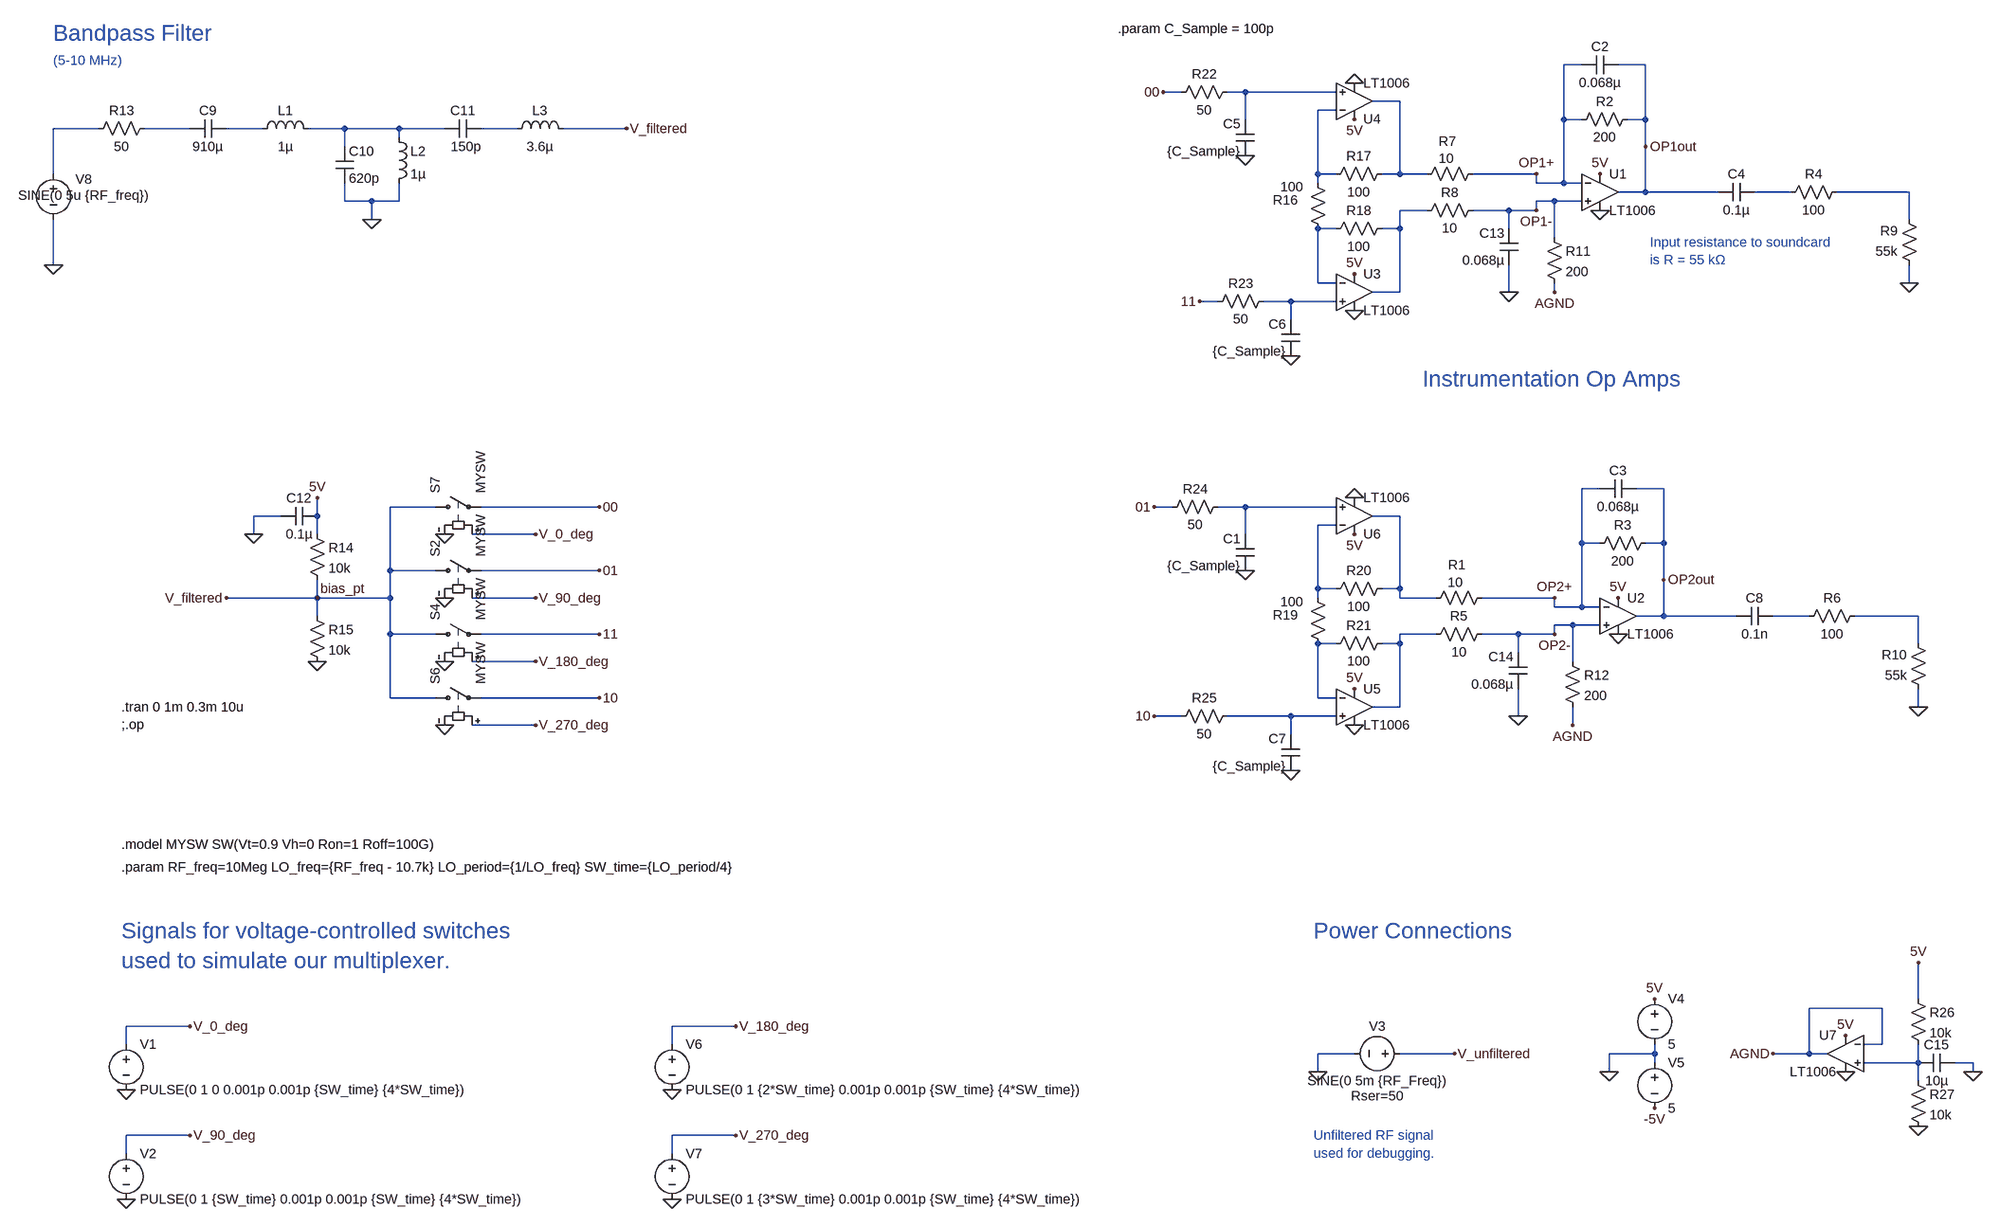
[diagram p0: schematic RecieverSimulation_1c.asc]
RecieverSimulation_1c.asc, the LTspice schematic file:
Version 4
SHEET 1 2720 1748
WIRE 1824 -1088 1792 -1088
WIRE 1936 -1088 1888 -1088
WIRE 1120 -1040 1088 -1040
WIRE 1232 -1040 1200 -1040
WIRE 1392 -1040 1232 -1040
WIRE 1504 -1024 1456 -1024
WIRE 1392 -1008 1360 -1008
WIRE 1232 -992 1232 -1040
WIRE 1792 -992 1792 -1088
WIRE 1824 -992 1792 -992
WIRE 1936 -992 1936 -1088
WIRE 1936 -992 1904 -992
WIRE -784 -976 -864 -976
WIRE -624 -976 -704 -976
WIRE -496 -976 -560 -976
WIRE -352 -976 -416 -976
WIRE -256 -976 -352 -976
WIRE -176 -976 -256 -976
WIRE -48 -976 -112 -976
WIRE 144 -976 32 -976
WIRE -256 -960 -256 -976
WIRE -352 -944 -352 -976
WIRE 1936 -944 1936 -992
WIRE -864 -896 -864 -976
WIRE 1360 -896 1360 -1008
WIRE 1392 -896 1360 -896
WIRE 1504 -896 1504 -1024
WIRE 1504 -896 1472 -896
WIRE 1552 -896 1504 -896
WIRE 1744 -896 1632 -896
WIRE 1360 -880 1360 -896
WIRE 1744 -880 1744 -896
WIRE 1792 -880 1792 -992
WIRE 1792 -880 1744 -880
WIRE 1824 -880 1792 -880
WIRE 1936 -864 1936 -944
WIRE 1936 -864 1888 -864
WIRE 2064 -864 1936 -864
WIRE 2192 -864 2128 -864
WIRE 2400 -864 2272 -864
WIRE -352 -848 -352 -880
WIRE -304 -848 -352 -848
WIRE -256 -848 -256 -880
WIRE -256 -848 -304 -848
WIRE 1776 -848 1744 -848
WIRE 1824 -848 1776 -848
WIRE 1552 -832 1504 -832
WIRE 1696 -832 1632 -832
WIRE 1744 -832 1744 -848
WIRE 1744 -832 1696 -832
WIRE -304 -816 -304 -848
WIRE 2400 -816 2400 -864
WIRE 1392 -800 1360 -800
WIRE 1504 -800 1504 -832
WIRE 1504 -800 1472 -800
WIRE 1696 -800 1696 -832
WIRE 1776 -784 1776 -848
WIRE -864 -736 -864 -816
WIRE 1360 -704 1360 -800
WIRE 1392 -704 1360 -704
WIRE 2400 -704 2400 -736
WIRE 1504 -688 1504 -800
WIRE 1504 -688 1456 -688
WIRE 1696 -688 1696 -736
WIRE 1776 -688 1776 -704
WIRE 1184 -672 1152 -672
WIRE 1312 -672 1264 -672
WIRE 1392 -672 1312 -672
WIRE 1312 -640 1312 -672
WIRE 1856 -224 1824 -224
WIRE 1968 -224 1920 -224
WIRE -192 -192 -272 -192
WIRE 96 -192 -112 -192
WIRE 1104 -192 1072 -192
WIRE 1232 -192 1184 -192
WIRE 1392 -192 1232 -192
WIRE -464 -176 -512 -176
WIRE -400 -176 -400 -208
WIRE 1504 -176 1456 -176
WIRE 1392 -160 1360 -160
WIRE -512 -144 -512 -176
WIRE -400 -144 -400 -176
WIRE -16 -144 -128 -144
WIRE 1232 -144 1232 -192
WIRE 1824 -128 1824 -224
WIRE 1856 -128 1824 -128
WIRE 1968 -128 1968 -224
WIRE 1968 -128 1936 -128
WIRE -272 -80 -272 -192
WIRE -192 -80 -272 -80
WIRE 96 -80 -112 -80
WIRE 1968 -64 1968 -128
WIRE 1360 -48 1360 -160
WIRE 1392 -48 1360 -48
WIRE 1504 -48 1504 -176
WIRE 1504 -48 1472 -48
WIRE -400 -32 -400 -64
WIRE -400 -32 -560 -32
WIRE -272 -32 -272 -80
WIRE -272 -32 -400 -32
WIRE -16 -32 -128 -32
WIRE 1360 -32 1360 -48
WIRE 1504 -32 1504 -48
WIRE 1568 -32 1504 -32
WIRE 1776 -32 1648 -32
WIRE 1776 -16 1776 -32
WIRE 1824 -16 1824 -128
WIRE 1824 -16 1776 -16
WIRE 1856 -16 1824 -16
WIRE -400 0 -400 -32
WIRE 1968 0 1968 -64
WIRE 1968 0 1920 0
WIRE 2096 0 1968 0
WIRE 2224 0 2160 0
WIRE 2416 0 2304 0
WIRE 1808 16 1776 16
WIRE 1856 16 1808 16
WIRE -272 32 -272 -32
WIRE -192 32 -272 32
WIRE 96 32 -112 32
WIRE 1568 32 1504 32
WIRE 1712 32 1648 32
WIRE 1776 32 1776 16
WIRE 1776 32 1712 32
WIRE 1392 48 1360 48
WIRE 1504 48 1504 32
WIRE 1504 48 1472 48
WIRE 2416 48 2416 0
WIRE 1712 64 1712 32
WIRE -16 80 -128 80
WIRE 1808 80 1808 16
WIRE -272 144 -272 32
WIRE -192 144 -272 144
WIRE 96 144 -112 144
WIRE 1360 144 1360 48
WIRE 1392 144 1360 144
WIRE 1504 160 1504 48
WIRE 1504 160 1456 160
WIRE 2416 160 2416 128
WIRE 1120 176 1072 176
WIRE 1312 176 1200 176
WIRE 1392 176 1312 176
WIRE 1712 176 1712 128
WIRE -16 192 -128 192
WIRE 1808 192 1808 160
WIRE 1312 208 1312 176
WIRE 2416 752 2416 688
WIRE 2352 768 2224 768
WIRE -624 800 -736 800
WIRE 336 800 224 800
WIRE -736 832 -736 800
WIRE 224 832 224 800
WIRE 2352 832 2352 768
WIRE 2352 832 2320 832
WIRE 1424 848 1360 848
WIRE 1600 848 1504 848
WIRE 1952 848 1952 832
WIRE 1952 848 1872 848
WIRE 2224 848 2224 768
WIRE 2224 848 2160 848
WIRE 2256 848 2224 848
WIRE 1952 864 1952 848
WIRE 2416 864 2416 832
WIRE 2416 864 2320 864
WIRE 2512 864 2480 864
WIRE 1360 880 1360 848
WIRE 1872 880 1872 848
WIRE 2512 880 2512 864
WIRE 2416 896 2416 864
WIRE -624 992 -736 992
WIRE 336 992 224 992
WIRE -736 1024 -736 992
WIRE 224 1024 224 992
FLAG -176 -144 0
FLAG -176 -32 0
FLAG -176 80 0
FLAG -176 192 0
FLAG 1360 880 0
FLAG 1952 752 5V
FLAG 1312 -576 0
FLAG 1232 -928 0
FLAG 1744 -896 OP1+
FLAG 1776 32 OP2-
FLAG 1744 -832 OP1-
FLAG 1936 -944 OP1out
FLAG 1968 -64 OP2out
FLAG 1776 -32 OP2+
FLAG 2400 -704 0
FLAG 2416 160 0
FLAG 1872 880 0
FLAG 1952 944 -5V
FLAG -16 -144 V_0_deg
FLAG -16 -32 V_90_deg
FLAG -16 80 V_180_deg
FLAG -16 192 V_270_deg
FLAG -736 912 0
FLAG -624 800 V_0_deg
FLAG -736 1104 0
FLAG -624 992 V_90_deg
FLAG 224 912 0
FLAG 336 800 V_180_deg
FLAG 224 1104 0
FLAG 336 992 V_270_deg
FLAG 96 -192 00
FLAG 96 32 11
FLAG 1088 -1040 00
FLAG 1152 -672 11
FLAG -864 -736 0
FLAG -304 -816 0
FLAG 144 -976 V_filtered
FLAG 1600 848 V_unfiltered
FLAG -560 -32 V_filtered
FLAG -400 -208 5V
FLAG -400 80 0
FLAG -400 -32 bias_pt
FLAG -512 -144 0
FLAG 1856 -832 0
FLAG 1856 -896 5V
FLAG 1424 -992 5V
FLAG 1424 -1056 0
FLAG 1424 -656 0
FLAG 1424 -720 5V
FLAG 1312 272 0
FLAG 1232 -80 0
FLAG 1072 -192 01
FLAG 1072 176 10
FLAG 1424 -144 5V
FLAG 1424 -208 0
FLAG 1424 192 0
FLAG 1424 128 5V
FLAG 96 -80 01
FLAG 96 144 10
FLAG 1696 -688 0
FLAG 1712 176 0
FLAG 1888 32 0
FLAG 1888 -32 5V
FLAG 2416 688 5V
FLAG 2416 976 0
FLAG 2512 880 0
FLAG 2160 848 AGND
FLAG 1776 -688 AGND
FLAG 1808 192 AGND
FLAG 2288 880 0
FLAG 2288 816 5V
SYMBOL sw -208 -192 R270
SYMATTR InstName S7
SYMATTR Value MYSW
SYMBOL sw -208 -80 R270
SYMATTR InstName S2
SYMATTR Value MYSW
SYMBOL sw -208 32 R270
SYMATTR InstName S4
SYMATTR Value MYSW
SYMBOL sw -208 144 R270
SYMATTR InstName S6
SYMATTR Value MYSW
SYMBOL voltage 1520 848 R90
WINDOW 0 -32 56 VBottom 2
WINDOW 3 32 56 VTop 2
WINDOW 123 0 0 Left 0
WINDOW 39 90 56 VBottom 2
SYMATTR InstName V3
SYMATTR Value SINE(0 5m {RF_Freq})
SYMATTR SpiceLine Rser=50
SYMBOL voltage 1952 736 R0
WINDOW 123 0 0 Left 0
WINDOW 39 0 0 Left 0
SYMATTR InstName V4
SYMATTR Value 5
SYMBOL cap 1248 -928 R180
WINDOW 0 24 56 Left 2
WINDOW 3 24 8 Left 2
SYMATTR InstName C5
SYMATTR Value {C_Sample}
SYMBOL cap 1328 -576 R180
WINDOW 0 24 56 Left 2
WINDOW 3 24 8 Left 2
SYMATTR InstName C6
SYMATTR Value {C_Sample}
SYMBOL res 1536 -880 R270
WINDOW 0 58 52 VTop 2
WINDOW 3 59 50 VBottom 2
SYMATTR InstName R7
SYMATTR Value 10
SYMBOL res 1648 -848 R90
WINDOW 0 0 56 VBottom 2
WINDOW 3 32 56 VTop 2
SYMATTR InstName R8
SYMATTR Value 10
SYMBOL res 1920 -1008 R90
WINDOW 0 0 56 VBottom 2
WINDOW 3 32 56 VTop 2
SYMATTR InstName R2
SYMATTR Value 200
SYMBOL cap 1888 -1104 R90
WINDOW 0 0 32 VBottom 2
WINDOW 3 32 32 VTop 2
SYMATTR InstName C2
SYMATTR Value 0.068µ
SYMBOL res 1952 -144 R90
WINDOW 0 0 56 VBottom 2
WINDOW 3 32 56 VTop 2
SYMATTR InstName R3
SYMATTR Value 200
SYMBOL cap 1920 -240 R90
WINDOW 0 0 32 VBottom 2
WINDOW 3 32 32 VTop 2
SYMATTR InstName C3
SYMATTR Value 0.068µ
SYMBOL cap 2128 -880 R90
WINDOW 0 0 32 VBottom 2
WINDOW 3 32 32 VTop 2
SYMATTR InstName C4
SYMATTR Value 0.1µ
SYMBOL cap 2160 -16 R90
WINDOW 0 0 32 VBottom 2
WINDOW 3 32 32 VTop 2
SYMATTR InstName C8
SYMATTR Value 0.1n
SYMBOL res 2288 -880 R90
WINDOW 0 0 56 VBottom 2
WINDOW 3 32 56 VTop 2
SYMATTR InstName R4
SYMATTR Value 100
SYMBOL res 2320 -16 R90
WINDOW 0 0 56 VBottom 2
WINDOW 3 32 56 VTop 2
SYMATTR InstName R6
SYMATTR Value 100
SYMBOL res 2416 -720 R180
WINDOW 0 36 76 Left 2
WINDOW 3 36 40 Left 2
SYMATTR InstName R9
SYMATTR Value 55k
SYMBOL res 2432 144 R180
WINDOW 0 36 76 Left 2
WINDOW 3 36 40 Left 2
SYMATTR InstName R10
SYMATTR Value 55k
SYMBOL voltage 1952 848 R0
WINDOW 123 0 0 Left 0
WINDOW 39 0 0 Left 0
SYMATTR InstName V5
SYMATTR Value 5
SYMBOL res 1760 -800 R0
SYMATTR InstName R11
SYMATTR Value 200
SYMBOL res 1792 64 R0
SYMATTR InstName R12
SYMATTR Value 200
SYMBOL voltage -736 816 R0
WINDOW 123 0 0 Left 0
WINDOW 39 0 0 Left 0
SYMATTR InstName V1
SYMATTR Value PULSE(0 1 0 0.001p 0.001p {SW_time} {4*SW_time})
SYMBOL voltage -736 1008 R0
WINDOW 123 0 0 Left 0
WINDOW 39 0 0 Left 0
SYMATTR InstName V2
SYMATTR Value PULSE(0 1 {SW_time} 0.001p 0.001p {SW_time} {4*SW_time})
SYMBOL voltage 224 816 R0
WINDOW 123 0 0 Left 0
WINDOW 39 0 0 Left 0
SYMATTR InstName V6
SYMATTR Value PULSE(0 1 {2*SW_time} 0.001p 0.001p {SW_time} {4*SW_time})
SYMBOL voltage 224 1008 R0
WINDOW 123 0 0 Left 0
WINDOW 39 0 0 Left 0
SYMATTR InstName V7
SYMATTR Value PULSE(0 1 {3*SW_time} 0.001p 0.001p {SW_time} {4*SW_time})
SYMBOL voltage -864 -912 R0
WINDOW 0 53 41 Bottom 2
WINDOW 3 53 69 Bottom 2
WINDOW 123 0 0 Left 0
WINDOW 39 60 56 VTop 2
SYMATTR InstName V8
SYMATTR Value SINE(0 5u {RF_freq})
SYMBOL cap -560 -992 R90
WINDOW 0 0 32 VBottom 2
WINDOW 3 32 32 VTop 2
SYMATTR InstName C9
SYMATTR Value 910µ
SYMBOL ind -512 -960 R270
WINDOW 0 32 56 VTop 2
WINDOW 3 0 56 VBottom 2
SYMATTR InstName L1
SYMATTR Value 1µ
SYMBOL cap -368 -944 R0
SYMATTR InstName C10
SYMATTR Value 620p
SYMBOL ind -272 -976 R0
SYMATTR InstName L2
SYMATTR Value 1µ
SYMBOL cap -112 -992 R90
WINDOW 0 0 32 VBottom 2
WINDOW 3 32 26 VTop 2
SYMATTR InstName C11
SYMATTR Value 150p
SYMBOL ind -64 -960 R270
WINDOW 0 32 56 VTop 2
WINDOW 3 0 56 VBottom 2
SYMATTR InstName L3
SYMATTR Value 3.6µ
SYMBOL res -688 -992 R90
WINDOW 0 0 56 VBottom 2
WINDOW 3 32 56 VTop 2
SYMATTR InstName R13
SYMATTR Value 50
SYMBOL res -416 -160 R0
SYMATTR InstName R14
SYMATTR Value 10k
SYMBOL res -416 -16 R0
SYMATTR InstName R15
SYMATTR Value 10k
SYMBOL cap -400 -192 R90
WINDOW 0 0 32 VBottom 2
WINDOW 3 32 32 VTop 2
SYMATTR InstName C12
SYMATTR Value 0.1µ
SYMBOL Opamps\\LT1006 1856 -928 R0
SYMATTR InstName U1
SYMBOL Opamps\\LT1006 1424 -752 R0
SYMATTR InstName U3
SYMBOL Opamps\\LT1006 1424 -960 M180
SYMATTR InstName U4
SYMBOL res 1344 -896 R0
WINDOW 0 -63 46 Left 2
WINDOW 3 -50 23 Left 2
SYMATTR InstName R16
SYMATTR Value 100
SYMBOL res 1488 -912 R90
WINDOW 0 0 56 VBottom 2
WINDOW 3 32 56 VTop 2
SYMATTR InstName R17
SYMATTR Value 100
SYMBOL res 1488 -816 R90
WINDOW 0 0 56 VBottom 2
WINDOW 3 32 56 VTop 2
SYMATTR InstName R18
SYMATTR Value 100
SYMBOL cap 1248 -80 R180
WINDOW 0 24 56 Left 2
WINDOW 3 24 8 Left 2
SYMATTR InstName C1
SYMATTR Value {C_Sample}
SYMBOL cap 1328 272 R180
WINDOW 0 24 56 Left 2
WINDOW 3 24 8 Left 2
SYMATTR InstName C7
SYMATTR Value {C_Sample}
SYMBOL Opamps\\LT1006 1424 96 R0
SYMATTR InstName U5
SYMBOL Opamps\\LT1006 1424 -112 M180
SYMATTR InstName U6
SYMBOL res 1344 -48 R0
WINDOW 0 -63 46 Left 2
WINDOW 3 -50 23 Left 2
SYMATTR InstName R19
SYMATTR Value 100
SYMBOL res 1488 -64 R90
WINDOW 0 0 56 VBottom 2
WINDOW 3 32 56 VTop 2
SYMATTR InstName R20
SYMATTR Value 100
SYMBOL res 1488 32 R90
WINDOW 0 0 56 VBottom 2
WINDOW 3 32 56 VTop 2
SYMATTR InstName R21
SYMATTR Value 100
SYMBOL cap 1712 -736 R180
WINDOW 0 24 56 Left 2
WINDOW 3 24 8 Left 2
SYMATTR InstName C13
SYMATTR Value 0.068µ
SYMBOL res 1552 -16 R270
WINDOW 0 58 52 VTop 2
WINDOW 3 59 50 VBottom 2
SYMATTR InstName R1
SYMATTR Value 10
SYMBOL res 1664 16 R90
WINDOW 0 0 56 VBottom 2
WINDOW 3 32 56 VTop 2
SYMATTR InstName R5
SYMATTR Value 10
SYMBOL cap 1728 128 R180
WINDOW 0 24 56 Left 2
WINDOW 3 24 8 Left 2
SYMATTR InstName C14
SYMATTR Value 0.068µ
SYMBOL res 1216 -1056 R90
WINDOW 0 0 56 VBottom 2
WINDOW 3 32 56 VTop 2
SYMATTR InstName R22
SYMATTR Value 50
SYMBOL res 1280 -688 R90
WINDOW 0 0 56 VBottom 2
WINDOW 3 32 56 VTop 2
SYMATTR InstName R23
SYMATTR Value 50
SYMBOL res 1200 -208 R90
WINDOW 0 0 56 VBottom 2
WINDOW 3 32 56 VTop 2
SYMATTR InstName R24
SYMATTR Value 50
SYMBOL res 1216 160 R90
WINDOW 0 0 56 VBottom 2
WINDOW 3 32 56 VTop 2
SYMATTR InstName R25
SYMATTR Value 50
SYMBOL Opamps\\LT1006 1888 -64 R0
SYMATTR InstName U2
SYMBOL res 2400 736 R0
SYMATTR InstName R26
SYMATTR Value 10k
SYMBOL res 2400 880 R0
SYMATTR InstName R27
SYMATTR Value 10k
SYMBOL cap 2416 880 R270
WINDOW 0 32 32 VTop 2
WINDOW 3 0 32 VBottom 2
SYMATTR InstName C15
SYMATTR Value 10µ
SYMBOL Opamps\\LT1006 2288 784 M0
SYMATTR InstName U7
TEXT -744 480 Left 2 !.model MYSW SW(Vt=0.9 Vh=0 Ron=1 Roff=100G)
TEXT -744 160 Left 2 !.tran 0 1m 0.3m 10u\n;.op
TEXT -744 520 Left 2 !.param RF_freq=10Meg LO_freq={RF_freq - 10.7k} LO_period={1/LO_freq} SW_time={LO_period/4}
TEXT 1008 -1152 Left 2 !.param C_Sample = 100p
TEXT -744 632 Left 4 ;Signals for voltage-controlled switches \nused to simulate our multiplexer.
TEXT 1944 -776 Left 2 ;Input resistance to soundcard\nis R = 55 kΩ
TEXT 1544 -536 Left 4 ;Instrumentation Op Amps
TEXT -864 -1144 Left 4 ;Bandpass Filter
TEXT -864 -1096 Left 2 ;(5-10 MHz)
TEXT 1352 632 Left 4 ;Power Connections
TEXT 1352 992 Left 2 ;Unfiltered RF signal\nused for debugging.

The netlist it stands for:
* RecieverSimulation_1c.asc
S7 bias_pt 00 V_0_deg 0 MYSW
S2 bias_pt 01 V_90_deg 0 MYSW
S4 bias_pt 11 V_180_deg 0 MYSW
S6 bias_pt 10 V_270_deg 0 MYSW
V3 V_unfiltered 0 SINE(0 5m {RF_Freq}) Rser=50
V4 5V 0 5
C5 0 N001 {C_Sample}
C6 0 N013 {C_Sample}
R7 N002 OP1+ 10
R8 OP1- N011 10
R2 OP1out OP1+ 200
C2 OP1out OP1+ 0.068µ
R3 OP2out OP2+ 200
C3 OP2out OP2+ 0.068µ
C4 N009 OP1out 0.1µ
C8 N017 OP2out 0.1n
R4 N010 N009 100
R6 N018 N017 100
R9 0 N010 55k
R10 0 N018 55k
V5 0 -5V 5
R11 OP1- AGND 200
R12 OP2- AGND 200
V1 V_0_deg 0 PULSE(0 1 0 0.001p 0.001p {SW_time} {4*SW_time})
V2 V_90_deg 0 PULSE(0 1 {SW_time} 0.001p 0.001p {SW_time} {4*SW_time})
V6 V_180_deg 0 PULSE(0 1 {2*SW_time} 0.001p 0.001p {SW_time} {4*SW_time})
V7 V_270_deg 0 PULSE(0 1 {3*SW_time} 0.001p 0.001p {SW_time} {4*SW_time})
V8 N004 0 SINE(0 5u {RF_freq})
C9 N006 N005 910µ
L1 N006 N007 1µ
C10 N007 0 620p
L2 N007 0 1µ
C11 N008 N007 150p
L3 N008 bias_pt 3.6µ
R13 N005 N004 50
R14 5V bias_pt 10k
R15 bias_pt 0 10k
C12 5V 0 0.1µ
XU1 OP1- OP1+ 5V 0 OP1out LT1006  ; pins In+ In- V+ V- OUT
XU3 N013 N012 5V 0 N011 LT1006  ; pins In+ In- V+ V- OUT
XU4 N001 N003 5V 0 N002 LT1006  ; pins In+ In- V+ V- OUT
R16 N003 N012 100
R17 N002 N003 100
R18 N011 N012 100
C1 0 N014 {C_Sample}
C7 0 N021 {C_Sample}
XU5 N021 N020 5V 0 N019 LT1006  ; pins In+ In- V+ V- OUT
XU6 N014 N016 5V 0 N015 LT1006  ; pins In+ In- V+ V- OUT
R19 N016 N020 100
R20 N015 N016 100
R21 N019 N020 100
C13 0 OP1- 0.068µ
R1 N015 OP2+ 10
R5 OP2- N019 10
C14 0 OP2- 0.068µ
R22 N001 00 50
R23 N013 11 50
R24 N014 01 50
R25 N021 10 50
XU2 OP2- OP2+ 5V 0 OP2out LT1006  ; pins In+ In- V+ V- OUT
R26 5V N022 10k
R27 N022 0 10k
C15 N022 0 10µ
XU7 N022 AGND 5V 0 AGND LT1006  ; pins In+ In- V+ V- OUT
.model MYSW SW(Vt=0.9 Vh=0 Ron=1 Roff=100G)
.tran 0 1m 0.3m 10u
;.op
.param RF_freq=10Meg LO_freq={RF_freq - 10.7k} LO_period={1/LO_freq} SW_time={LO_period/4}
.param C_Sample = 100p
* Signals for voltage-controlled switches
* used to simulate our multiplexer.
* Input resistance to soundcard
* is R = 55 kΩ
* Instrumentation Op Amps
* Bandpass Filter
* (5-10 MHz)
* Power Connections
* Unfiltered RF signal
* used for debugging.
.lib LTC.lib
.backanno
.end